# Altium schematic sheet LEDs.SchDoc
size A
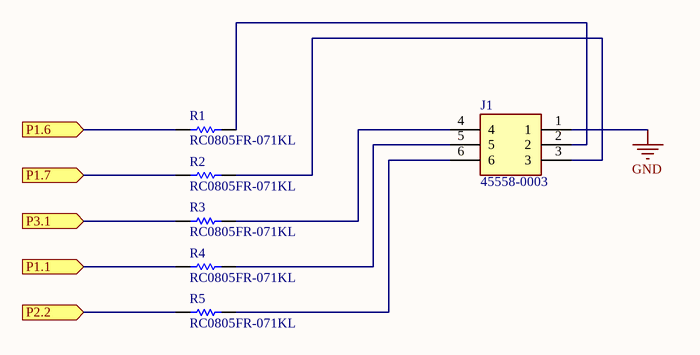
[diagram p0: LEDs.SchDoc]

## Parts
J1  45558-0003  [455580003]
R1  RC0805FR-071KL  [RESC2013X60X35ML10T20]
R2  RC0805FR-071KL  [RESC2013X60X35ML10T20]
R3  RC0805FR-071KL  [RESC2013X60X35ML10T20]
R4  RC0805FR-071KL  [RESC2013X60X35ML10T20]
R5  RC0805FR-071KL  [RESC2013X60X35ML10T20]

## Ports
P1.1 (in), P1.6 (in), P1.7 (in), P2.2 (in), P3.1 (in)

## Nets
GND: J1.1
P1.1: R4.1 ; port P1.1
P1.6: R1.1 ; port P1.6
P1.7: R2.1 ; port P1.7
P2.2: R5.1 ; port P2.2
P3.1: R3.1 ; port P3.1
NetJ1_2: J1.2 R1.2
NetJ1_3: J1.3 R2.2
NetJ1_4: J1.4 R3.2
NetJ1_5: J1.5 R4.2
NetJ1_6: J1.6 R5.2

## Library data of the parts
J1 = 45558-0003: Connector; Manufacturer_Name: Molex; Datasheet Link: https://www.molex.com/pdm_docs/sd/455580003_sd.pdf; Height: 10mm; Manufacturer_Part_Number: 45558-0003; Mouser Part Number: 538-45558-0003; Mouser Price/Stock: https://www.mouser.co.uk/ProductDetail/Molex/45558-0003?qs=c7kbnNtxOmgPtIF7q2whYA%3D%3D
R1-R5 = CMP-2100-03671-1: Chip Resistor, 1 KOhm, +/- 1%, 125 mW, -55 to 155 degC, 0805 (2012 Metric), RoHS, Tape and Reel; Manufacturer: Yageo; Temperature Coefficient: 100ppm/degreesC; Voltage Rating (DC): 150V; Max Power Dissipation: 125mW; Resistance: 1KOhm; Number of Pins: 2; Number of Terminations: 2; Datasheet URL: http://www.yageo.com/NewPortal/yageodocoutput?fileName=/pdf/R-Chip/PYu-RC_Group_51_RoHS_L_5.pdf; Length: 0.079inch; Package Description: 2-Pin Surface Mounted Device, Body 2 x 1.25 mm; Depth: 1.25mm; Height: 0.024inch; Military Standard: Not; Case/Package: 0805; Package Reference: 0805; RoHSCompliant: true; Lead Free: LeadFree; Packaging: TapeandReel; Package Quantity: 1; Datasheet Version: Rev. 5, 10/2016; Tolerance: 1%; Min Operating Temperature: -55degC; Voltage Rating: 150V; Composition: ThickFilm; Case Code (Imperial): 0805; Power Rating: 125mW; Width: 0.049inch; Case Code (Metric): 2012; Manufacturer URL: http://www.yageo.com/; Max Operating Temperature: 155degC; REACH SVHC: Unknown; Termination: SMD/SMT